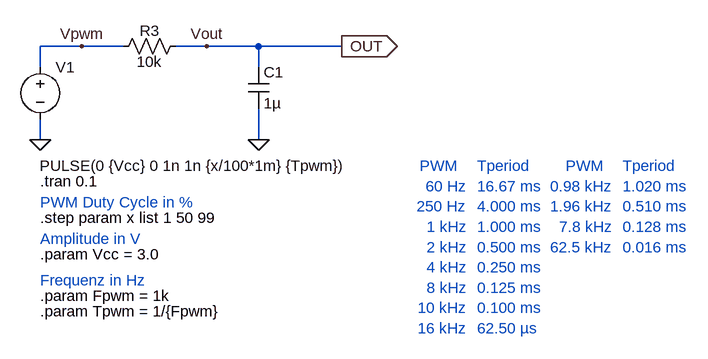
[diagram p0: schematic Draft1 PWM Test.asc]
Draft1 PWM Test.asc, the LTspice schematic file:
Version 4
SHEET 1 888 680
WIRE -128 208 -192 208
WIRE -64 208 -128 208
WIRE 64 208 16 208
WIRE 144 208 64 208
WIRE 272 208 144 208
WIRE -192 240 -192 208
WIRE 144 240 144 208
WIRE -192 352 -192 320
WIRE 144 352 144 304
FLAG -192 352 0
FLAG 272 208 OUT
IOPIN 272 208 Out
FLAG -128 208 Vpwm
FLAG 144 352 0
FLAG 64 208 Vout
SYMBOL voltage -192 224 R0
WINDOW 3 -1 168 Left 2
WINDOW 123 0 0 Left 0
WINDOW 39 0 0 Left 0
SYMATTR Value PULSE(0 {Vcc} 0 1n 1n {x/100*1m} {Tpwm})
SYMATTR InstName V1
SYMBOL res 32 192 R90
WINDOW 0 8 56 VBottom 2
WINDOW 3 24 56 VTop 2
SYMATTR InstName R3
SYMATTR Value 10k
SYMBOL cap 128 240 R0
SYMATTR InstName C1
SYMATTR Value 1µ
TEXT -192 416 Left 2 !.tran 0.1
TEXT -192 472 Left 2 !.step param x list 1 50 99
TEXT -192 448 Left 2 ;PWM Duty Cycle in %
TEXT -192 504 Left 2 ;Amplitude in V
TEXT -192 568 Left 2 ;Frequenz in Hz
TEXT -192 528 Left 2 !.param Vcc = 3.0
TEXT -192 592 Left 2 !.param Fpwm = 1k
TEXT -192 616 Left 2 !.param Tpwm = 1/{Fpwm}
TEXT 688 392 Right 2 ;PWM  \n0.98 kHz\n1.96 kHz\n7.8 kHz\n62.5 kHz
TEXT 704 392 Left 2 ;Tperiod\n1.020 ms\n0.510 ms\n0.128 ms\n0.016 ms
TEXT 464 392 Right 2 ;PWM  \n60 Hz\n250 Hz\n1 kHz\n2 kHz\n4 kHz\n8 kHz\n10 kHz\n16 kHz
TEXT 480 392 Left 2 ;Tperiod\n16.67 ms\n4.000 ms\n1.000 ms\n0.500 ms\n0.250 ms\n0.125 ms\n0.100 ms\n62.50 µs

The netlist it stands for:
* Draft1 PWM Test.asc
V1 Vpwm 0 PULSE(0 {Vcc} 0 1n 1n {x/100*1m} {Tpwm})
R3 Vout Vpwm 10k
C1 Vout 0 1µ
.tran 0.1
.step param x list 1 50 99
* PWM Duty Cycle in %
* Amplitude in V
* Frequenz in Hz
.param Vcc = 3.0
.param Fpwm = 1k
.param Tpwm = 1/{Fpwm}
* PWM
* 0.98 kHz
* 1.96 kHz
* 7.8 kHz
* 62.5 kHz
* Tperiod
* 1.020 ms
* 0.510 ms
* 0.128 ms
* 0.016 ms
* PWM
* 60 Hz
* 250 Hz
* 1 kHz
* 2 kHz
* 4 kHz
* 8 kHz
* 10 kHz
* 16 kHz
* Tperiod
* 16.67 ms
* 4.000 ms
* 1.000 ms
* 0.500 ms
* 0.250 ms
* 0.125 ms
* 0.100 ms
* 62.50 µs
.backanno
.end